# EAGLE schematic esquematico1 (EAGLE 9.6.0)
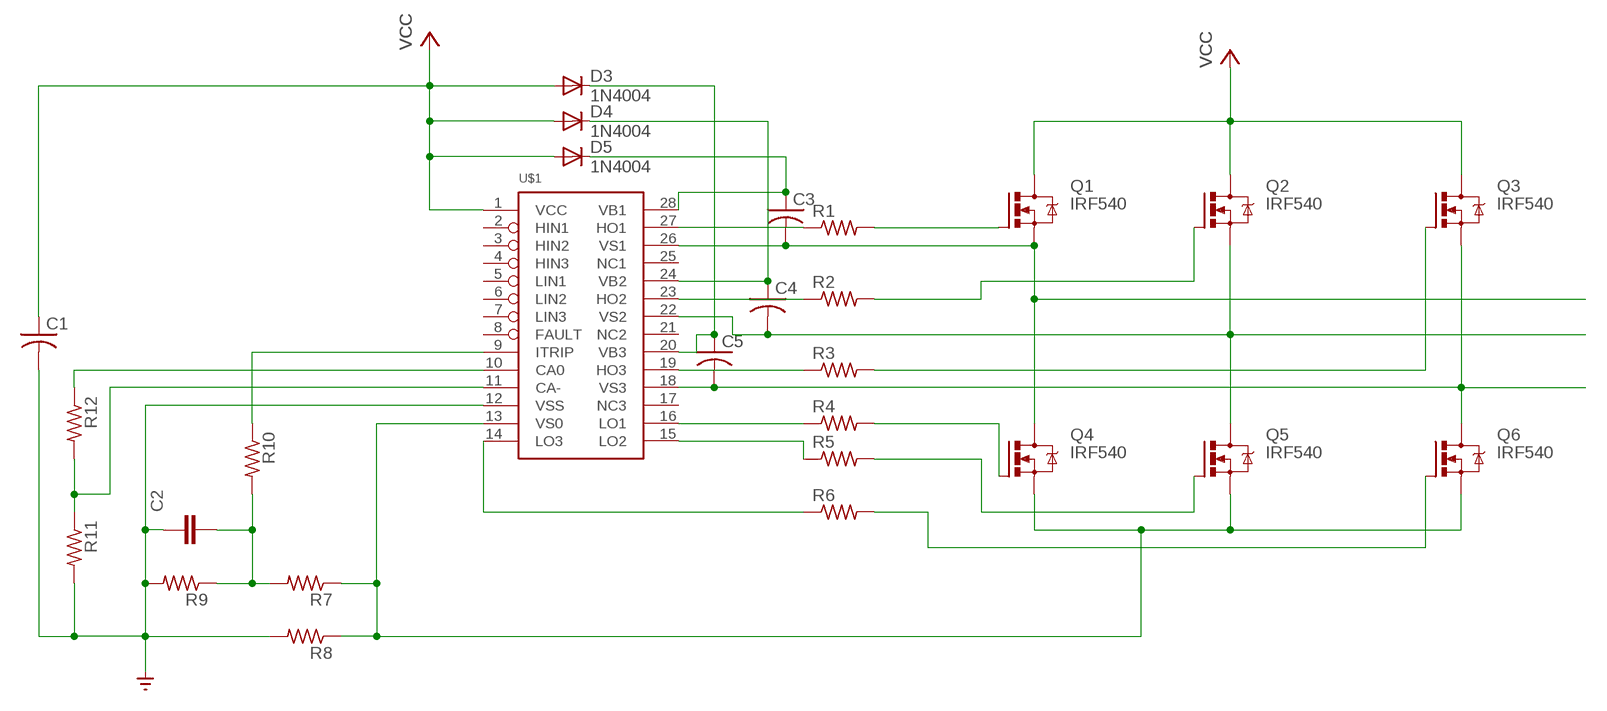
[diagram p0: schematic, sheet 1]

## Parts
C1  C-US025-024X044  [C025-024X044]
C2  C_CHIP-0402(1005-METRIC)  [CAPC1005X60]
C3  C-US025-024X044  [C025-024X044]
C4  C-US025-024X044  [C025-024X044]
C5  C-US025-024X044  [C025-024X044]
D3  1N4004  [DO41-10]
D4  1N4004  [DO41-10]
D5  1N4004  [DO41-10]
Q1  IRF540  [TO220BV]
Q2  IRF540  [TO220BV]
Q3  IRF540  [TO220BV]
Q4  IRF540  [TO220BV]
Q5  IRF540  [TO220BV]
Q6  IRF540  [TO220BV]
R1  FLIPFLOP-RES  [0805-THM]
R2  FLIPFLOP-RES  [0805-THM]
R3  FLIPFLOP-RES  [0805-THM]
R4  FLIPFLOP-RES  [0805-THM]
R5  FLIPFLOP-RES  [0805-THM]
R6  FLIPFLOP-RES  [0805-THM]
R7  FLIPFLOP-RES  [0805-THM]
R8  FLIPFLOP-RES  [0805-THM]
R9  FLIPFLOP-RES  [0805-THM]
R10  FLIPFLOP-RES  [0805-THM]
R11  FLIPFLOP-RES  [0805-THM]
R12  FLIPFLOP-RES  [0805-THM]
U$1  IR2130  [SO-28W]

## Nets
GND: C1.2 C2.1 R8.2 R9.2 R11.2 U$1.12(VSS) ; supply symbol labelled SUPPLY0_GND_
N$1: Q1.G R1.2
N$2: R4.1 U$1.16(LO1)
N$3: Q4.G R4.2
N$4: R5.1 U$1.15(LO2)
N$5: C3.2 Q1.S Q4.D U$1.26(VS1)
N$6: C4.2 Q2.S Q5.D U$1.22(VS2)
N$7: R1.1 U$1.27(HO1)
N$8: R2.1 U$1.23(HO2)
N$9: Q2.G R2.2
N$10: R3.1 U$1.19(HO3)
N$11: Q3.G R3.2
N$12: C5.2 Q3.S Q6.D U$1.18(VS3)
N$13: Q5.G R5.2
N$14: R6.1 U$1.14(LO3)
N$15: Q6.G R6.2
N$16: Q4.S Q5.S Q6.S R7.1 R8.1 U$1.13(VS0)
N$17: C2.2 R7.2 R9.1 R10.2
N$18: R10.1 U$1.9(ITRIP)
N$19: R11.1 R12.2 U$1.11(CA-)
N$21: R12.1 U$1.10(CA0)
N$22: C1.1 D3.A D4.A D5.A U$1.1(VCC) ; supply symbol labelled VCC
N$23: C4.1 D4.C U$1.24(VB2)
N$24: C3.1 D5.C U$1.28(VB1)
N$25: C5.1 D3.C U$1.20(VB3)
VCC: Q1.D Q2.D Q3.D
Unconnected: U$1.2(HIN1) U$1.3(HIN2) U$1.4(HIN3) U$1.5(LIN1) U$1.6(LIN2) U$1.7(LIN3) U$1.8(FAULT) U$1.17(NC3) U$1.21(NC2) U$1.25(NC1)

## Library data of the parts
C1 C3-C5 = adafruit:C-US: CAPACITOR, American symbol
C2 = Capacitor:C: Capacitor - Generic; CATEGORY: Capacitor
D3-D5 = adafruit:1N4004: DIODE General purpose 1N400x type rectifier (With bigger pads) http://www.ladyada.net/library/pcb/eaglelibrary.html
Q1-Q6 = transistor-power:IRF540: HEXFET Power MOSFET
R1-R12 = adafruit:FLIPFLOP-RES: Flip Flop resistor An 0805 resistor inside a standard 1/4W 5% resistor. Makes for easy mods
U$1 = IR2130:IR2130; AVAILABILITY: Unavailable; DESCRIPTION: Half-Bridge Gate Driver IC Inverting 28-PDIP; MF: Infineon Technologies; MP: IR2130; PACKAGE: DIP-28 Infineon Technologies; PRICE: None